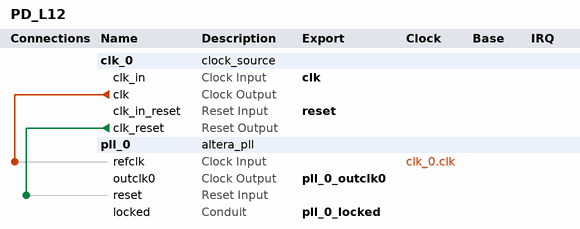
[diagram p0: system contents]
# Platform Designer (Qsys) system PD_L12, Cyclone V 5CSXFC6D6F31C6
# Parameters at their usual value, and those the tool derives, are not listed.
package require -exact qsys 20.1
create_system PD_L12
set_project_property DEVICE_FAMILY {Cyclone V}
set_project_property DEVICE 5CSXFC6D6F31C6

add_instance clk_0 clock_source 20.1
set_instance_parameter_value clk_0 clockFrequency 50000000

add_instance pll_0 altera_pll 20.1
set_instance_parameter_value pll_0 gui_device_speed_grade 1
set_instance_parameter_value pll_0 gui_number_of_clocks 1
set_instance_parameter_value pll_0 gui_operation_mode direct
set_instance_parameter_value pll_0 gui_output_clock_frequency0 1.0
set_instance_parameter_value pll_0 gui_pll_mode {Integer-N PLL}
set_instance_parameter_value pll_0 gui_reference_clock_frequency 50.0
set_instance_parameter_value pll_0 gui_use_locked true

# connections
add_connection clk_0.clk pll_0.refclk clock
add_connection clk_0.clk_reset pll_0.reset reset

# exported interfaces
add_interface clk clock sink
set_interface_property clk EXPORT_OF clk_0.clk_in
add_interface pll_0_locked conduit end
set_interface_property pll_0_locked EXPORT_OF pll_0.locked
add_interface pll_0_outclk0 clock source
set_interface_property pll_0_outclk0 EXPORT_OF pll_0.outclk0
add_interface reset reset sink
set_interface_property reset EXPORT_OF clk_0.clk_in_reset

set_interconnect_requirement {$system} qsys_mm.clockCrossingAdapter HANDSHAKE
set_interconnect_requirement {$system} qsys_mm.enableEccProtection FALSE
set_interconnect_requirement {$system} qsys_mm.insertDefaultSlave FALSE
set_interconnect_requirement {$system} qsys_mm.maxAdditionalLatency 1

save_system PD_L12.qsys
